# EAGLE design Dtmf (EAGLE 5.10)
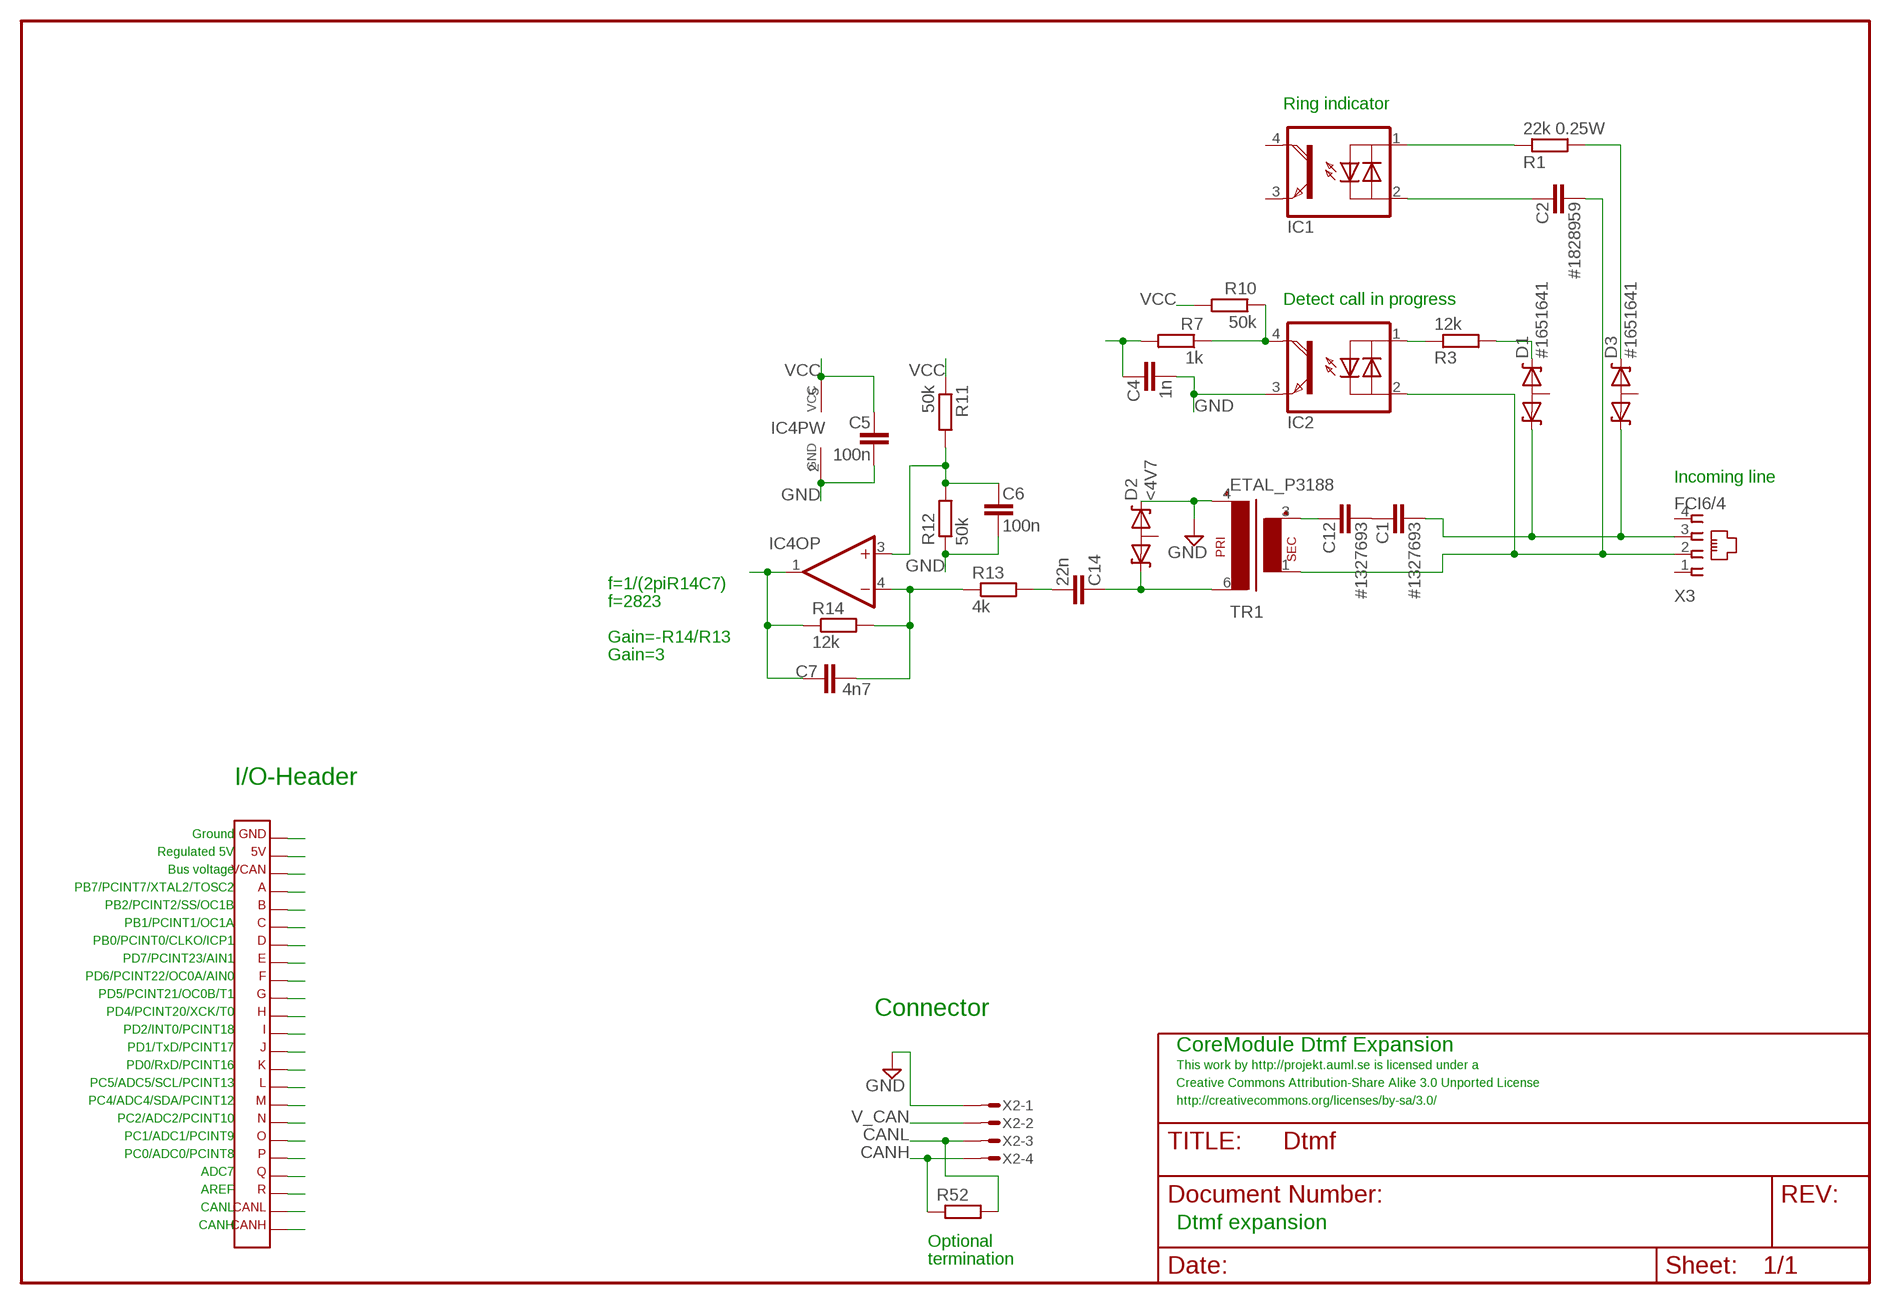
[diagram p0: schematic, sheet 1]

## Parts
C1  #1327693  C-EUC0805  [C0805]
C2  #1828959  C-EUC1210  [C1210]
C4  1n  C-EUC0603  [C0603]
C5  100n  C-EUC0603  [C0603]
C6  100n  C-EUC0603  [C0603]
C7  4n7  C-EUC0603  [C0603]
C12  #1327693  C-EUC0805  [C0805]
C14  22n  C-EUC0805  [C0805]
D1  #1651641  TVSSOT23  [SOT23]
D2  <4V7  TVSSOT23  [SOT23]
D3  #1651641  TVSSOT23  [SOT23]
IC1  HCPL-354SMD-MINI  [SMD-MINI]
IC2  HCPL-354SMD-MINI  [SMD-MINI]
IC4  NCS2001SQ2T2SOT23-5  [SOT23-5]
R1  22k 0.25W  R-EUR1206  [R1206]
R3  12k  R-EUR0805  [R0805]
R7  1k  R-EUR0603  [R0603]
R10  50k  R-EUR0603  [R0603]
R11  50k  R-EUR0603  [R0603]
R12  50k  R-EUR0603  [R0603]
R13  4k  R-EUR0603  [R0603]
R14  12k  R-EUR0603  [R0603]
R52  R-EUR0603  [R0603]
TR1  ETAL_P3188  [ETAL_P3188]
X1  CORETWO_LAYOUTISPHOLES_CU  [CORETWO_LAYOUT_ISPHOLES_CU]
X2  MICROMATCH-4  [MICROMATCH-4]
X3  FCI6/4  [FCI6/4]

## Nets
CANH: R52.1 X1.CANH X2.4
CANL: R52.2 X1.CANL X2.3
CUR_DIV: C6.1 IC4.3(OP:+IN) R11.2 R12.2
EXP_A: X1.A
EXP_B: X1.B
EXP_C: X1.C
EXP_D: X1.D
EXP_E: X1.E
EXP_F: X1.F
EXP_G: X1.G
EXP_H: X1.H
EXP_I: X1.I
EXP_J: X1.J
EXP_K: X1.K
EXP_L: X1.L
EXP_M: X1.M
EXP_N: X1.N
EXP_O: X1.O
EXP_P: X1.P
EXP_Q: X1.Q
EXP_R: X1.R
GND: C4.2 C5.2 C6.2 D2.1(C1) IC2.3(E) IC4.2(PW:GND) R12.1 TR1.4 X1.GND X2.1
N$1: IC1.1(A) R1.1
N$2: D3.1(C1) R1.2
N$3: C1.1 C12.2
N$4: C2.1 IC1.2(C)
N$7: IC2.1(A) R3.1
N$8: D1.1(C1) R3.2
N$9: C12.1 TR1.3
N$11: C1.2 D1.2(C2) D3.2(C2) X3.3
N$12: IC2.4(COL) R7.1 R10.1
N$15: C14.1 D2.2(C2) TR1.6
N$16: C14.2 R13.2
N$20: C2.2 IC2.2(C) TR1.1 X3.2
OP_NEG: C7.1 IC4.4(OP:-IN) R13.1 R14.2
RENAME_NET: C4.1 R7.2
RENAME_NET2: C7.2 IC4.1(OP:OUT) R14.1
V_CAN: X1.VCAN X2.2
VCC: C5.1 IC4.5(PW:VCC) R10.2 R11.1 X1.5V
Unconnected: D1.3(A) D2.3(A) D3.3(A) IC1.3(E) IC1.4(COL) X3.1 X3.4

## Notes on the sheet
- Ring indicator
- Detect call in progress
- Incoming line
- f=1/(2piR14C7)
- f=2823
- Gain=-R14/R13
- Gain=3
- I/O-Header
- Ground
- Regulated 5V
- Bus voltage
- PB7/PCINT7/XTAL2/TOSC2
- PB2/PCINT2/SS/OC1B
- PB1/PCINT1/OC1A
- PB0/PCINT0/CLKO/ICP1
- PD7/PCINT23/AIN1
- PD6/PCINT22/OC0A/AIN0
- PD5/PCINT21/OC0B/T1
- PD4/PCINT20/XCK/T0 | Connector
- PD2/INT0/PCINT18
- PD1/TxD/PCINT17 | CoreModule Dtmf Expansion
- PD0/RxD/PCINT16 | This work by http://projekt.auml.se is licensed under a
- PC5/ADC5/SCL/PCINT13 | Creative Commons Attribution-Share Alike 3.0 Unported License
- PC4/ADC4/SDA/PCINT12 | http://creativecommons.org/licenses/by-sa/3.0/
- PC2/ADC2/PCINT10
- PC1/ADC1/PCINT9
- PC0/ADC0/PCINT8
- ADC7
- AREF
- CANL
- CANH | Dtmf expansion
- Optional
- termination

## Library data of the parts
C1 C2 C4-C7 C12 C14 = rcl:C-EU
D1-D3 = diode:TVS
IC1 IC2 = optocoupler_hcpl-354:HCPL-354
IC4 = NCS2001:NCS2001SQ2T2
R1 R3 R7 R10-R14 R52 = rcl:R-EU
TR1 = etal_trafo:ETAL_P3188
X1 = expboard:CORETWO_LAYOUT
X2 = con-amp-micromatch:MICROMATCH-4: MicroMaTch 4 7-215464-4 / 0-215464-4 Drawing Number C-215464 DDEController.pdf
X3 = fci-modular:FCI6/4

## Board
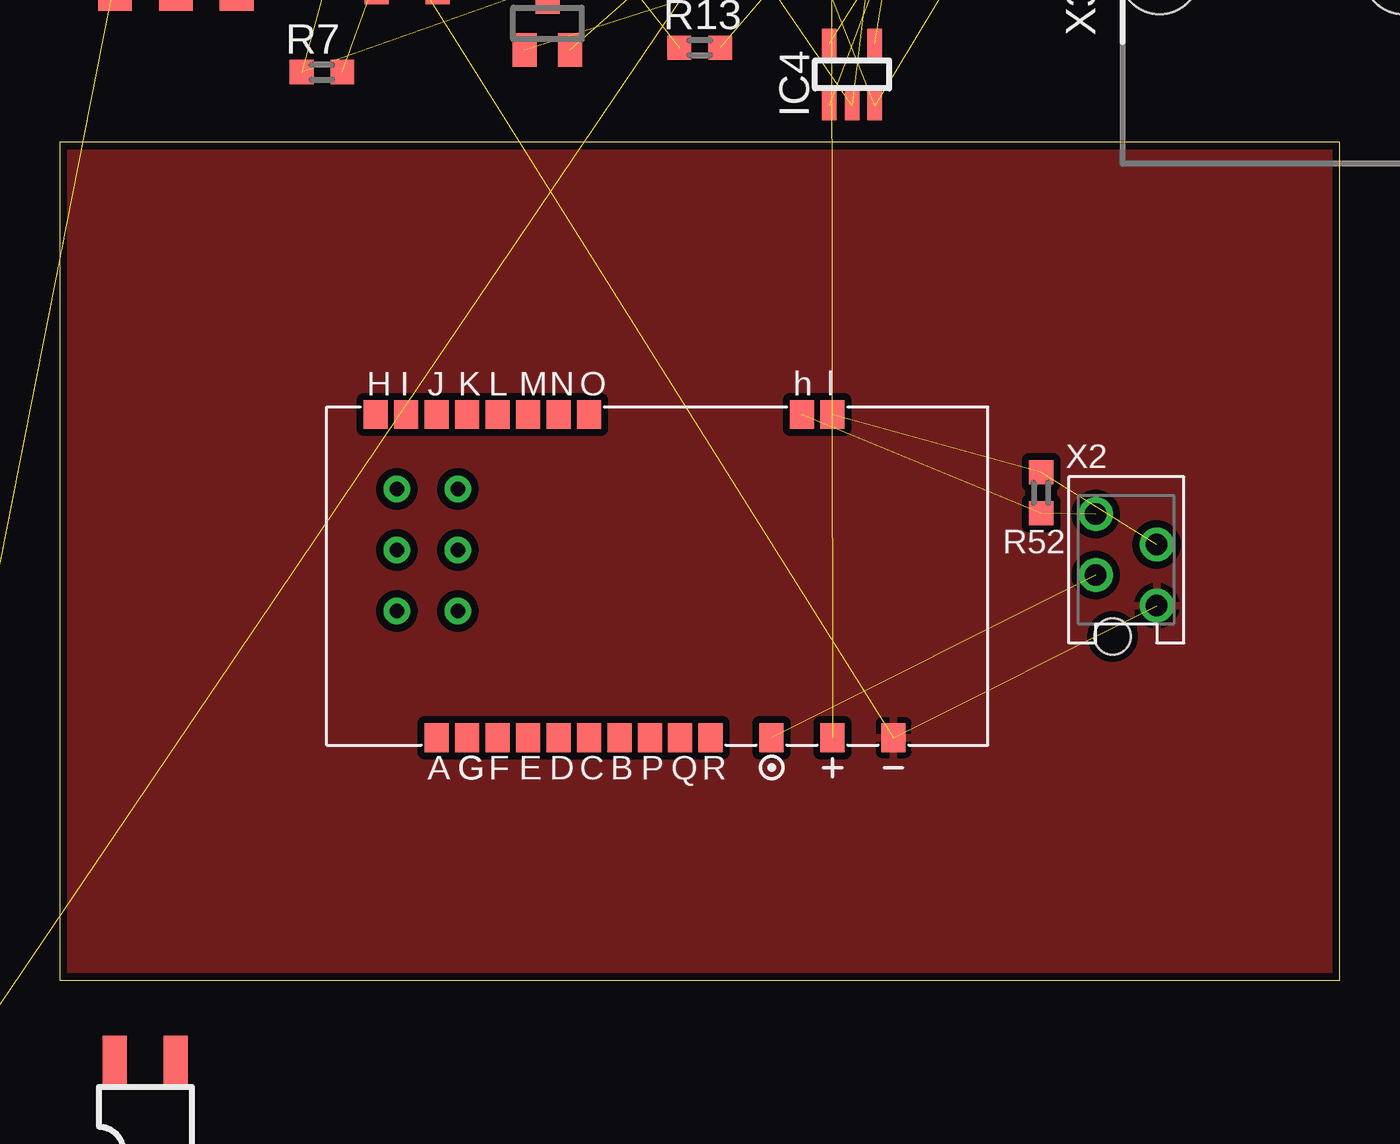
[diagram p1: board, top side]
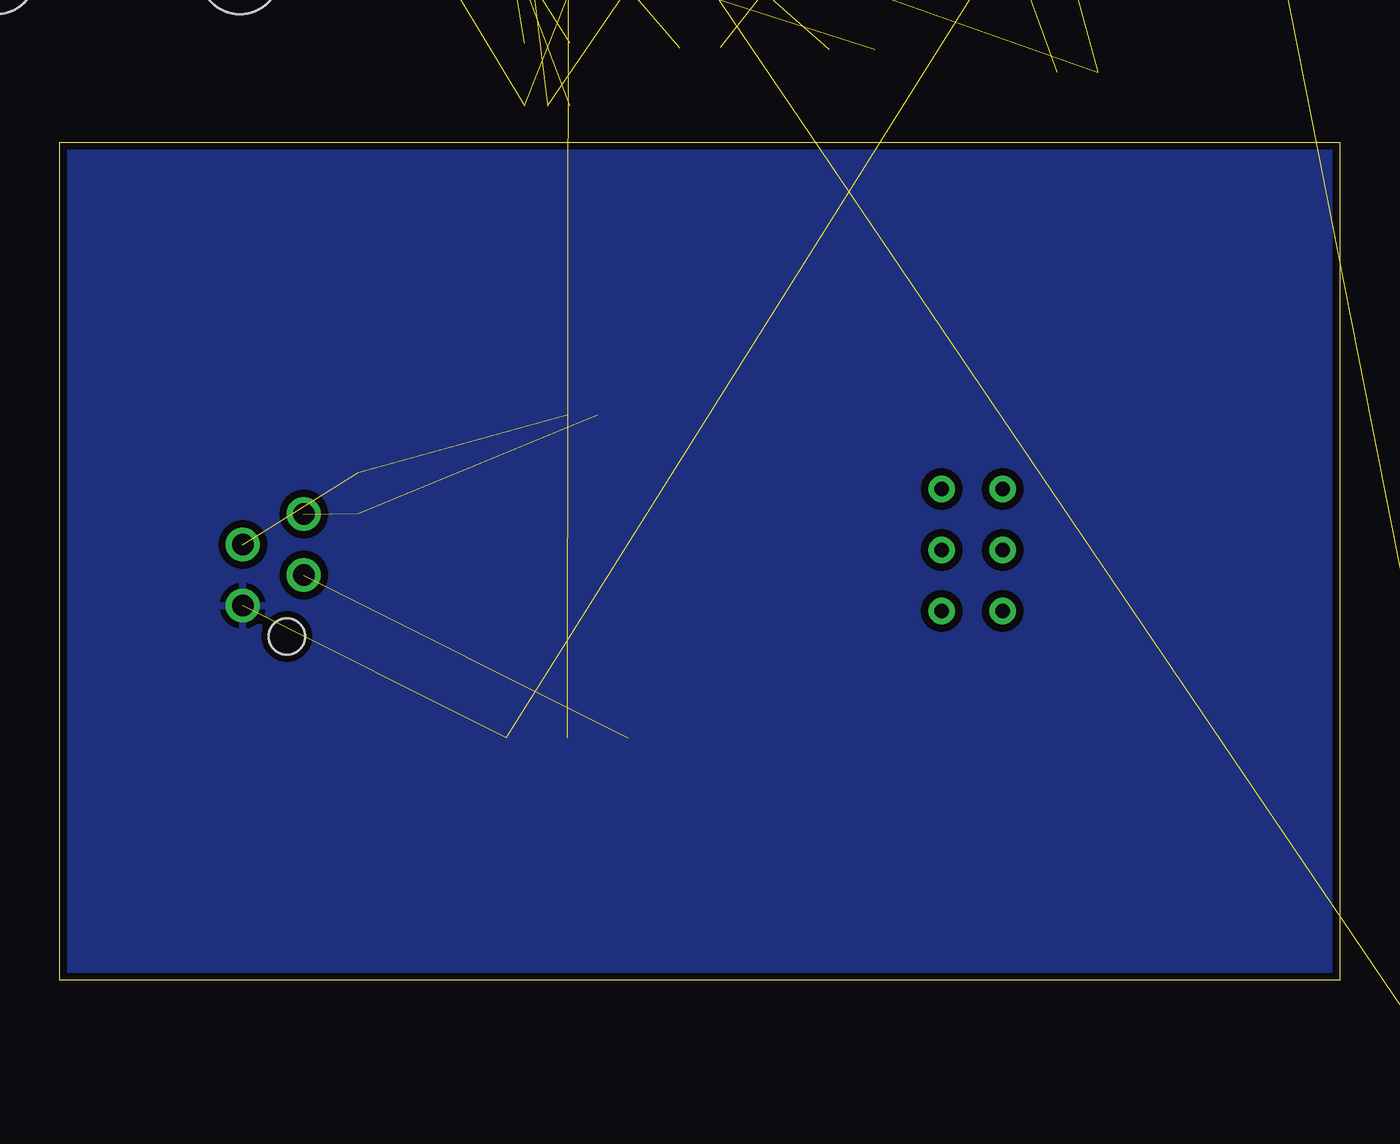
[diagram p2: board, bottom side, seen from below]

Size 53.34 x 34.92 mm. Coordinates in mm from the lower left corner, seen from the top.
Outline: 0,0 53.34,0 53.34,34.92 0,34.92 0,0
Copper layers (1*16): Top 0.035mm / dielectric 1.5mm / Bottom 0.035mm
Design rules "default": minimum track width 10mil, minimum drill 0.4mm, track to track 10mil, track to pad 10mil, pad to pad 10mil, via to via 10mil, smd to smd 8mil, copper to edge 10mil, drill to drill 8mil, minimum pad ring 10mil, minimum via ring 10mil, stop-mask expansion 4mil, vias tented up to drill 18mil, thermal gap 10mil

### Footprints (pad centres in the part's own frame; a part is rotated, then mirrored left to right if it is on the bottom)
C0805 = smd 1.3 x 1.5: 1 -0.85,0; 2 0.85,0
C1210 = smd 1.4 x 2.7: 1 -1.4,0; 2 1.5,0
C0603 = smd 1 x 1: 1 -0.85,0; 2 0.85,0
SOT23 = smd 1 x 1.4: 1 -0.95,-1.1; 2 0.95,-1.1; 3 0,1.1
SMD-MINI = smd 1 x 2: 1 -2.54,-3.795; 2 0,-3.795; 3 0,3.795; 4 -2.54,3.795
SOT23-5 = smd 0.6 x 1.2: 1 -0.95,-0.636; 2 0,-0.636; 3 0.95,-0.636; 4 0.95,1.976; 5 -0.95,1.976
R1206 = smd 1.6 x 1.803: 1 -1.422,0; 2 1.422,0
R0805 = smd 1.3 x 1.5: 1 -0.85,0; 2 0.85,0
R0603 = smd 0.991 x 1.016: 1 -0.85,0; 2 0.85,0
ETAL_P3188 = smd 1.4 x 2.5: 1 0,-5.08; 2 2.54,-5.08; 3 5.08,-5.08; 4 5.08,6.985; 5 2.54,6.985; 6 0,6.985
CORETWO_LAYOUT_ISPHOLES_CU = smd 1 x 1.2: 5V 7.315,-6.648; A -9.195,-6.648; B -1.575,-6.648; C -2.845,-6.648; CANH 6.045,6.814; CANL 7.315,6.814; D -4.115,-6.648; E -5.385,-6.648; F -6.655,-6.648; G -7.925,-6.648; GND 9.855,-6.648; H -11.735,6.814; I -10.465,6.814; J -9.195,6.814; K -7.925,6.814; L -6.655,6.814; M -5.385,6.814; N -4.115,6.814; O -2.845,6.814; P -0.305,-6.648; Q 0.965,-6.648; R 2.235,-6.648; VCAN 4.775,-6.648 | drill 0.6 round: P$1 -10.846,3.708; P$2 -8.306,3.708; P$3 -10.846,1.168; P$4 -8.306,1.168; P$5 -8.306,-1.372; P$6 -10.846,-1.372
MICROMATCH-4 = drill 0.9 round: 1 1.905,1.27; 2 0.635,-1.27; 3 -0.635,1.27; 4 -1.905,-1.27 | hole 1.5: 3.199,-0.562
FCI6/4 = drill 0.9 round: 1 -8.636,-2.794; 2 -7.366,-0.254; 3 -6.096,-2.794; 4 -4.826,-0.254 | hole 3.3: -11.811,-9.144; -1.651,-9.144

### Placement (x,y rotation side)
C1  27.43,44.45 0 top  (outside the outline)
C2  -10.67,-16.51 0 top  (outside the outline)
C4  19.05,55.63 0 top  (outside the outline)
C5  33.02,43.43 0 top  (outside the outline)
C6  27.18,49.53 0 top  (outside the outline)
C7  36.83,51.31 0 top  (outside the outline)
C12  30.48,53.59 0 top  (outside the outline)
C14  40.64,55.12 0 top  (outside the outline)
D1  36.58,55.37 0 top  (outside the outline)
D2  20.32,39.88 0 top  (outside the outline)
D3  -9.91,-9.4 0 top  (outside the outline)
IC1  4.83,-7.11 0 top  (outside the outline)
IC2  15.75,45.47 0 top  (outside the outline)
IC4  33.02,37.08 0 top
R1  -4.06,-9.91 0 top  (outside the outline)
R3  31.5,49.02 0 top  (outside the outline)
R7  10.92,37.85 0 top
R10  36.07,46.74 0 top  (outside the outline)
R11  41.91,51.05 0 top  (outside the outline)
R12  25.91,54.61 0 top  (outside the outline)
R13  26.67,38.86 0 top  (outside the outline)
R14  13.97,52.83 0 top  (outside the outline)
R52  40.89,20.32 90 top
TR1  2.29,46.74 0 top  (outside the outline)
X1  24.89,16.76 0 top
X2  44.45,17.53 270 top
X3  57.66,51.05 0 top  (outside the outline)

### Tracks (layer width: path | path; a pad name or v marks a point on that pad's centre or on a via)
CANH  (2 unrouted)
CANL  (2 unrouted)
CUR_DIV  (3 unrouted)
GND  (9 unrouted)
  pour Bottom (isolate 0.305, rank 3): 0,34.92 53.34,34.92 53.34,0 0,0
  pour Top (isolate 0.305, rank 3): 0,34.92 53.34,34.92 53.34,0 0,0
N$1  (1 unrouted)
N$2  (1 unrouted)
N$3  (1 unrouted)
N$4  (1 unrouted)
N$7  (1 unrouted)
N$8  (1 unrouted)
N$9  (1 unrouted)
N$11  (3 unrouted)
N$12  (2 unrouted)
N$15  (2 unrouted)
N$16  (1 unrouted)
N$20  (3 unrouted)
OP_NEG  (3 unrouted)
RENAME_NET  (1 unrouted)
RENAME_NET2  (2 unrouted)
V_CAN  (1 unrouted)
VCC  (4 unrouted)

### Text on the board
Document: Creative Commons Attribution-Share Alike 3.0 Unported License | This work by http://projekt.auml.se is licensed under a | http://creativecommons.org/licenses/by-sa/3.0/